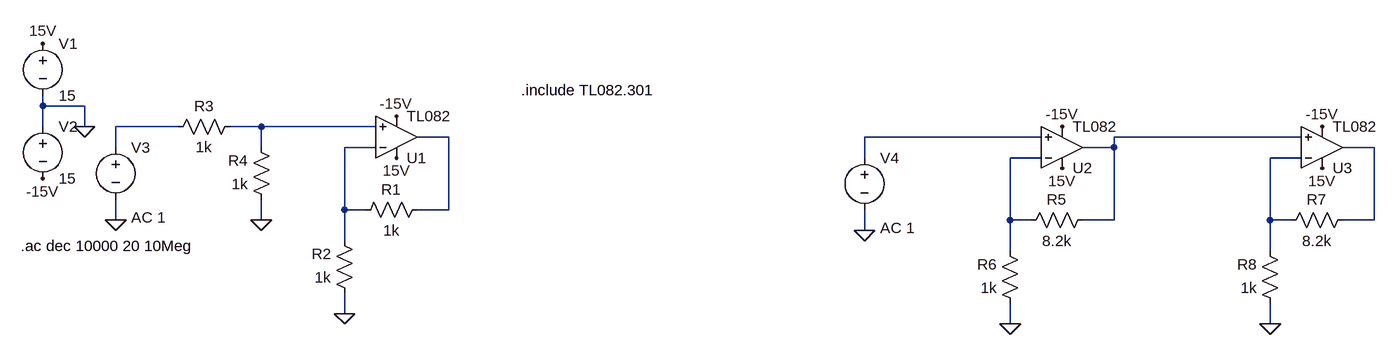
[diagram p0: schematic Test2.asc]
Test2.asc, the LTspice schematic file:
Version 4
SHEET 1 1884 680
WIRE -176 96 -176 80
WIRE -112 96 -176 96
WIRE -176 128 -176 96
WIRE -112 128 -112 96
WIRE 32 128 -64 128
WIRE 160 128 112 128
WIRE 336 128 160 128
WIRE 448 144 400 144
WIRE 1360 144 1088 144
WIRE 1760 144 1472 144
WIRE -64 160 -64 128
WIRE 160 160 160 128
WIRE 336 160 288 160
WIRE 1472 160 1472 144
WIRE 1472 160 1424 160
WIRE 1872 160 1824 160
WIRE 1088 176 1088 144
WIRE 1360 176 1312 176
WIRE 1760 176 1712 176
WIRE 288 256 288 160
WIRE 320 256 288 256
WIRE 448 256 448 144
WIRE 448 256 400 256
WIRE -64 272 -64 240
WIRE 160 272 160 240
WIRE 1312 272 1312 176
WIRE 1344 272 1312 272
WIRE 1472 272 1472 160
WIRE 1472 272 1424 272
WIRE 1712 272 1712 176
WIRE 1744 272 1712 272
WIRE 1872 272 1872 160
WIRE 1872 272 1824 272
WIRE 1088 288 1088 256
WIRE 288 304 288 256
WIRE 1312 320 1312 272
WIRE 1712 320 1712 272
WIRE 288 416 288 384
WIRE 1312 432 1312 400
WIRE 1712 432 1712 400
FLAG -112 128 0
FLAG -176 208 -15V
FLAG -176 0 15V
FLAG 368 176 15V
FLAG 368 112 -15V
FLAG -64 272 0
FLAG 288 416 0
FLAG 160 272 0
FLAG 1392 192 15V
FLAG 1392 128 -15V
FLAG 1312 432 0
FLAG 1088 288 0
FLAG 1792 192 15V
FLAG 1792 128 -15V
FLAG 1712 432 0
SYMBOL voltage -176 -16 R0
WINDOW 123 0 0 Left 0
WINDOW 39 0 0 Left 0
SYMATTR InstName V1
SYMATTR Value 15
SYMBOL voltage -176 112 R0
WINDOW 123 0 0 Left 0
WINDOW 39 0 0 Left 0
SYMATTR InstName V2
SYMATTR Value 15
SYMBOL voltage -64 144 R0
WINDOW 123 24 124 Left 2
WINDOW 39 0 0 Left 0
SYMATTR InstName V3
SYMATTR Value ""
SYMATTR Value2 AC 1
SYMBOL res 416 240 R90
WINDOW 0 0 56 VBottom 2
WINDOW 3 32 56 VTop 2
SYMATTR InstName R1
SYMATTR Value 1k
SYMBOL res 304 400 R180
WINDOW 0 36 76 Left 2
WINDOW 3 36 40 Left 2
SYMATTR InstName R2
SYMATTR Value 1k
SYMBOL res 128 112 R90
WINDOW 0 0 56 VBottom 2
WINDOW 3 32 56 VTop 2
SYMATTR InstName R3
SYMATTR Value 1k
SYMBOL res 176 256 R180
WINDOW 0 36 76 Left 2
WINDOW 3 36 40 Left 2
SYMATTR InstName R4
SYMATTR Value 1k
SYMBOL Opamps\\opamp2 368 208 M180
SYMATTR InstName U1
SYMATTR Value TL082
SYMBOL res 1440 256 R90
WINDOW 0 0 56 VBottom 2
WINDOW 3 32 56 VTop 2
SYMATTR InstName R5
SYMATTR Value 8.2k
SYMBOL res 1328 416 R180
WINDOW 0 36 76 Left 2
WINDOW 3 36 40 Left 2
SYMATTR InstName R6
SYMATTR Value 1k
SYMBOL Opamps\\opamp2 1392 224 M180
SYMATTR InstName U2
SYMATTR Value TL082
SYMBOL voltage 1088 160 R0
WINDOW 123 24 124 Left 2
WINDOW 39 0 0 Left 0
SYMATTR InstName V4
SYMATTR Value ""
SYMATTR Value2 AC 1
SYMBOL res 1840 256 R90
WINDOW 0 0 56 VBottom 2
WINDOW 3 32 56 VTop 2
SYMATTR InstName R7
SYMATTR Value 8.2k
SYMBOL res 1728 416 R180
WINDOW 0 36 76 Left 2
WINDOW 3 36 40 Left 2
SYMATTR InstName R8
SYMATTR Value 1k
SYMBOL Opamps\\opamp2 1792 224 M180
SYMATTR InstName U3
SYMATTR Value TL082
TEXT -210 312 Left 2 !.ac dec 10000 20 10Meg
TEXT 560 72 Left 2 !.include TL082.301

The netlist it stands for:
* Test2.asc
V1 15V 0 15
V2 0 -15V 15
V3 N001 0 AC 1
R1 N003 N006 1k
R2 0 N006 1k
R3 N002 N001 1k
R4 0 N002 1k
XU1 N002 N006 15V -15V N003 TL082  ; pins In+ In- V+ V- OUT
R5 N005 N008 8.2k
R6 0 N008 1k
XU2 N004 N008 15V -15V N005 TL082  ; pins In+ In- V+ V- OUT
V4 N004 0 AC 1
R7 N007 N009 8.2k
R8 0 N009 1k
XU3 N005 N009 15V -15V N007 TL082  ; pins In+ In- V+ V- OUT
.ac dec 10000 20 10Meg
.include TL082.301
.backanno
.end